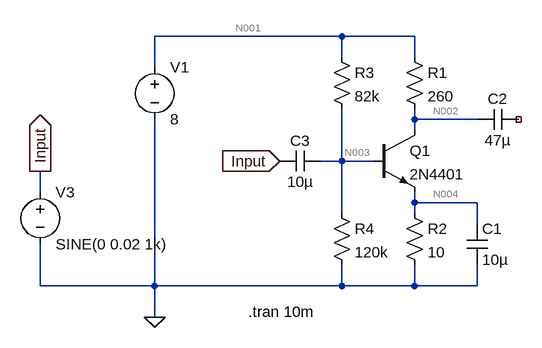
[diagram p0: schematic Emitterverstärkerschaltung.asc]
Emitterverstärkerschaltung.asc, the LTspice schematic file:
Version 4.1
SHEET 1 880 680
WIRE 256 0 -32 0
WIRE 368 0 256 0
WIRE 256 32 256 0
WIRE 368 32 368 0
WIRE -32 48 -32 0
WIRE 368 128 368 112
WIRE 464 128 368 128
WIRE 368 144 368 128
WIRE 256 192 256 112
WIRE 256 192 224 192
WIRE 304 192 256 192
WIRE -208 240 -208 208
WIRE 368 256 368 240
WIRE 464 256 368 256
WIRE 256 272 256 192
WIRE 368 272 368 256
WIRE 464 288 464 256
WIRE -208 384 -208 320
WIRE -32 384 -32 128
WIRE -32 384 -208 384
WIRE 256 384 256 352
WIRE 256 384 -32 384
WIRE 368 384 368 352
WIRE 368 384 256 384
WIRE 464 384 464 352
WIRE 464 384 368 384
WIRE -32 432 -32 384
FLAG -32 432 0
FLAG 160 192 Input
IOPIN 160 192 In
FLAG -208 208 Input
IOPIN -208 208 Out
SYMBOL voltage -32 32 R0
WINDOW 123 0 0 Left 0
WINDOW 39 0 0 Left 0
SYMATTR InstName V1
SYMATTR Value 8
SYMBOL res 352 16 R0
SYMATTR InstName R1
SYMATTR Value 260
SYMBOL npn 304 144 R0
SYMATTR InstName Q1
SYMATTR Value 2N4401
SYMBOL res 352 256 R0
SYMATTR InstName R2
SYMATTR Value 10
SYMBOL cap 448 288 R0
SYMATTR InstName C1
SYMATTR Value 10µ
SYMBOL cap 528 112 R90
WINDOW 0 0 32 VBottom 2
WINDOW 3 32 32 VTop 2
SYMATTR InstName C2
SYMATTR Value 47µ
SYMBOL cap 224 176 R90
WINDOW 0 0 32 VBottom 2
WINDOW 3 32 32 VTop 2
SYMATTR InstName C3
SYMATTR Value 10µ
SYMBOL voltage -208 224 R0
WINDOW 123 0 0 Left 0
WINDOW 39 0 0 Left 0
SYMATTR InstName V3
SYMATTR Value SINE(0 0.02 1k)
SYMBOL res 240 16 R0
SYMATTR InstName R3
SYMATTR Value 82k
SYMBOL res 240 256 R0
SYMATTR InstName R4
SYMATTR Value 120k
TEXT 112 424 Left 2 !.tran 10m

The netlist it stands for:
* Emitterverstärkerschaltung.asc
V1 N001 0 8
R1 N001 N002 260
Q1 N002 N003 N004 0 2N4401
R2 N004 0 10
C1 N004 0 10µ
C2 NC_01 N002 47µ
C3 N003 Input 10µ
V3 Input 0 SINE(0 0.02 1k)
R3 N001 N003 82k
R4 N003 0 120k
.model NPN NPN
.model PNP PNP
.lib standard.bjt
.tran 10m
.backanno
.end

* Results of the author's LTspice run, read from the files saved beside the schematic
* Operating Point, zero values left out:
*   V(n002) = 4.077 V
*   V(n004) = 151.7 mV
*   V(n001) = 8 V
*   V(n003) = 853.9 mV
*   I(V1) = -15.18 mA
*   Ic(Q1) = 15.09 mA
*   Ib(Q1) = 80.03 µA
*   Ie(Q1) = -15.17 mA
*   I(R2) = 15.17 mA
*   I(R3) = 87.15 µA
*   I(R4) = 7.116 µA
*   I(R1) = 15.09 mA
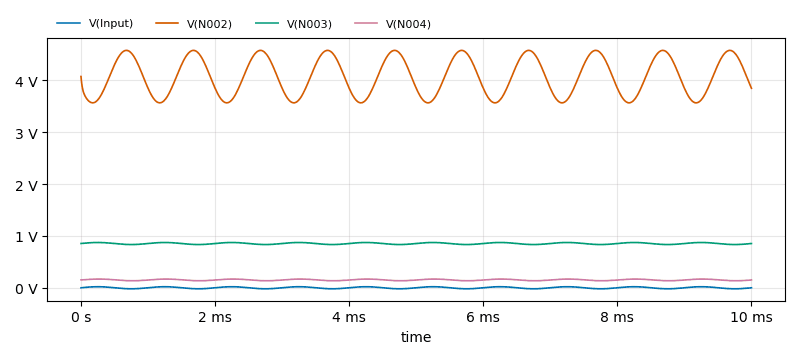
[diagram p1: Transient Analysis of Emitterverstärkerschaltung.asc, plotted from the saved traces]
* Transient Analysis, 1 run:
*   V(Input): min -19.99 mV, max 20 mV, average 100.9 nV, rms 14.14 mV, last 0 V
*   V(N002): min 3.568 V, max 4.581 V, average 4.078 V, rms 4.094 V, last 3.849 V
*   V(N003): min 833.9 mV, max 873.7 mV, average 853.8 mV, rms 853.9 mV, last 853.9 mV
*   V(N004): min 135.1 mV, max 168.3 mV, average 151.7 mV, rms 152.1 mV, last 150 mV